# Altium project Deej Board.PrjPcb
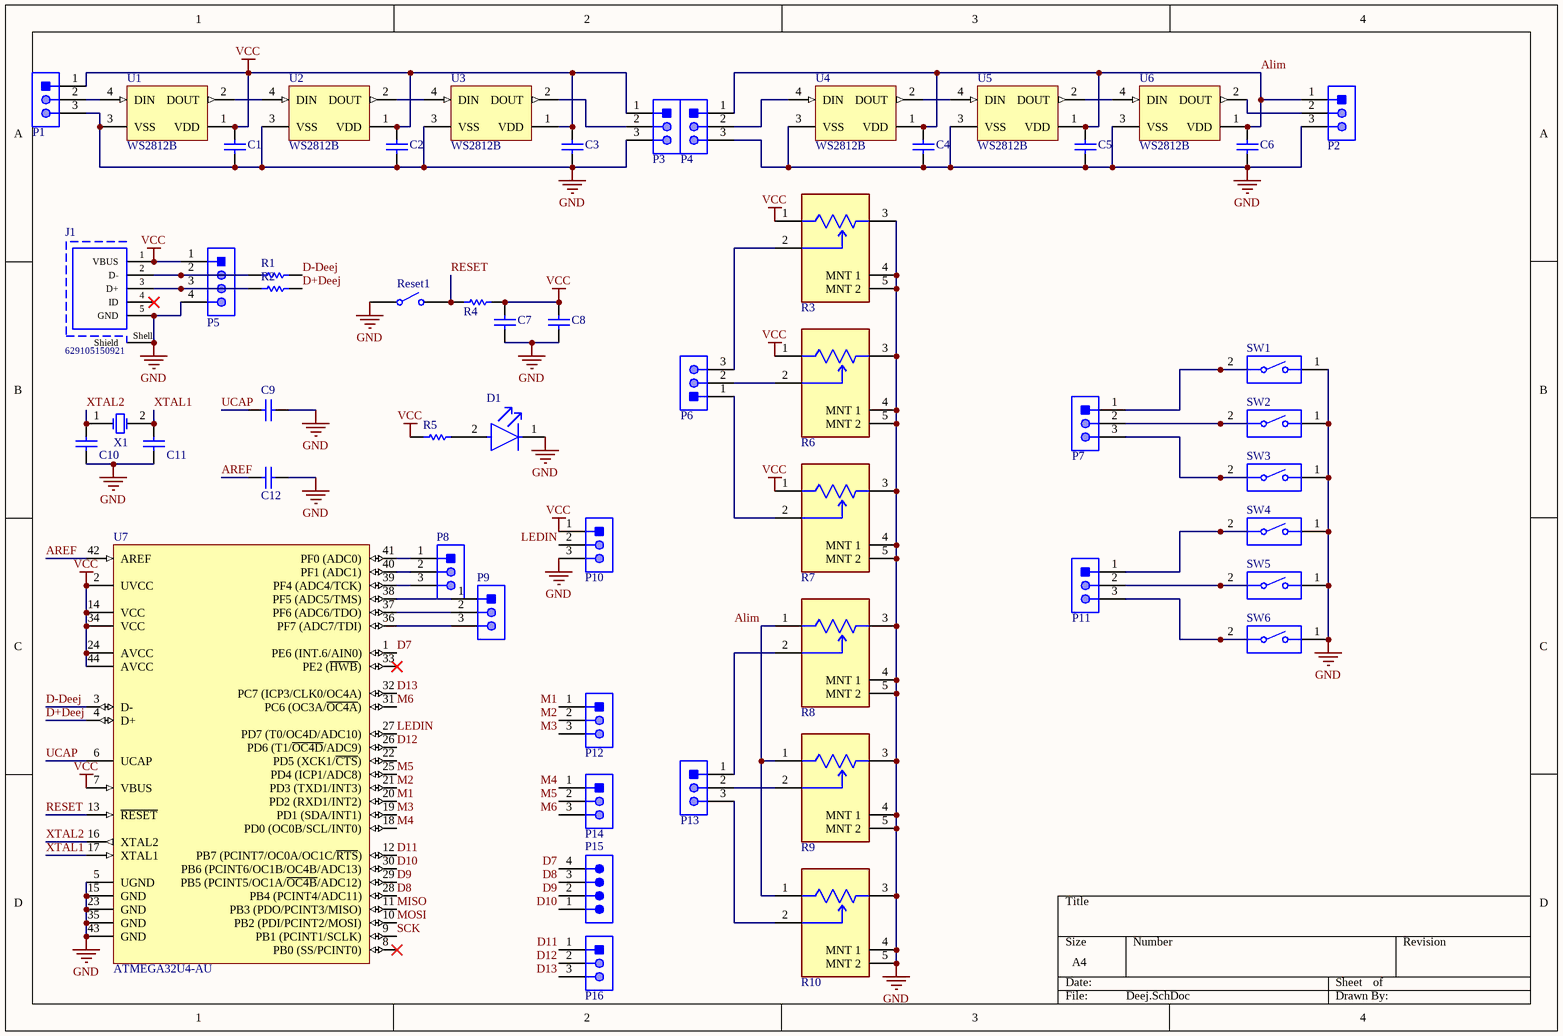
[diagram p0: Deej.SchDoc]
2 sheets, 87 parts. Net scope: global (net labels, ports and power ports of the same name join across sheets).
Board files: V1.PcbDoc, V2.PcbDoc, PCB1.PcbDoc
Sheets:
  Deej.SchDoc
  usb HUB.SchDoc

## Sheet Deej.SchDoc
size A4

### Parts
C1  GRM31C5C1E104JA01L  [CAPC3216X180X55LL20T25]  (value not drawn)
C2  GRM31C5C1E104JA01L  [CAPC3216X180X55LL20T25]  (value not drawn)
C3  GRM31C5C1E104JA01L  [CAPC3216X180X55LL20T25]  (value not drawn)
C4  GRM31C5C1E104JA01L  [CAPC3216X180X55LL20T25]  (value not drawn)
C5  GRM31C5C1E104JA01L  [CAPC3216X180X55LL20T25]  (value not drawn)
C6  GRM31C5C1E104JA01L  [CAPC3216X180X55LL20T25]  (value not drawn)
C7  GRM31C5C1E104JA01L  [CAPC3216X180X55LL20T25]  (value not drawn)
C8  GRM31C5C1E104JA01L  [CAPC3216X180X55LL20T25]  (value not drawn)
C9  C1206C105K3RACTU  [CAPC3216X180X50ML20T25]  (value not drawn)
C10  CAP 22pF 50V 1206(3216)  [CAPC1206(3216)100_N]  (value not drawn)
C11  CAP 22 pF 50V 1206(3216)  [CAPC1206(3216)100_N]  (value not drawn)
C12  GRM31C5C1E104JA01L  [CAPC3216X180X55LL20T25]  (value not drawn)
D1  APTD3216CGCK  [FP-APTD3216CGCK-MFG]  (value not drawn)
J1  629105150921  [629105150921]
P1  22-28-4033  [MOLX-22-28-4033_V]  (value not drawn)
P2  22-28-4033  [MOLX-22-28-4033_V]  (value not drawn)
P3  22-28-4033  [MOLX-22-28-4033_V]  (value not drawn)
P4  22-28-4033  [MOLX-22-28-4033_V]  (value not drawn)
P5  61300411121  [61300411121]  (value not drawn)
P6  22-28-4033  [MOLX-22-28-4033_V]  (value not drawn)
P7  22-28-4033  [MOLX-22-28-4033_V]  (value not drawn)
P8  22-28-4033  [MOLX-22-28-4033_V]  (value not drawn)
P9  22-28-4033  [MOLX-22-28-4033_V]  (value not drawn)
P10  22-28-4033  [MOLX-22-28-4033_V]  (value not drawn)
P11  22-28-4033  [MOLX-22-28-4033_V]  (value not drawn)
P12  22-28-4033  [MOLX-22-28-4033_V]  (value not drawn)
P13  22-28-4033  [MOLX-22-28-4033_V]  (value not drawn)
P14  22-28-4033  [MOLX-22-28-4033_V]  (value not drawn)
P15  TSW-104-08-T-S  [SMTC-TSW-104-08-X-S]  (value not drawn)
P16  22-28-4033  [MOLX-22-28-4033_V]  (value not drawn)
R1  ERJ-8GEYJ220V  [RESC3216X70X50NL05T20]  (value not drawn)
R2  ERJ-8GEYJ220V  [RESC3216X70X50NL05T20]  (value not drawn)
R3  PTV09A-4020U-B103  [FP-PTV09A-4-MFG]  (value not drawn)
R4  ERJ-P08J103V  [RESC3216X70X50LL05T20]  (value not drawn)
R5  ERJ8ENF2203V  [RESC3216X70X50LL05T20]  (value not drawn)
R6  PTV09A-4020U-B103  [FP-PTV09A-4-MFG]  (value not drawn)
R7  PTV09A-4020U-B103  [FP-PTV09A-4-MFG]  (value not drawn)
R8  PTV09A-4020U-B103  [FP-PTV09A-4-MFG]  (value not drawn)
R9  PTV09A-4020U-B103  [FP-PTV09A-4-MFG]  (value not drawn)
R10  PTV09A-4020U-B103  [FP-PTV09A-4-MFG]  (value not drawn)
Reset1  434121025816  [434121025816]  (value not drawn)
SW1  MX1A-11NW  [CHRY-MX1A-11NW_V]  (value not drawn)
SW2  MX1A-11NW  [CHRY-MX1A-11NW_V]  (value not drawn)
SW3  MX1A-11NW  [CHRY-MX1A-11NW_V]  (value not drawn)
SW4  MX1A-11NW  [CHRY-MX1A-11NW_V]  (value not drawn)
SW5  MX1A-11NW  [CHRY-MX1A-11NW_V]  (value not drawn)
SW6  MX1A-11NW  [CHRY-MX1A-11NW_V]  (value not drawn)
U1  WS2812B  [ADAI-WS2812B_V]
U2  WS2812B  [ADAI-WS2812B_V]
U3  WS2812B  [ADAI-WS2812B_V]
U4  WS2812B  [ADAI-WS2812B_V]
U5  WS2812B  [ADAI-WS2812B_V]
U6  WS2812B  [ADAI-WS2812B_V]
U7  ATMEGA32U4-AU  [ATML-44ML_M]
X1  9C-3.6864MBBK-T  [TXC-9C-2_V]  (value not drawn)

### Nets
GND: C1.1 C2.1 C3.1 C4.1 C5.1 C6.1 C7.1 C8.1 C9.2 C10.1 C11.1 C12.1 D1.1(C) J1.5(GND) J1.Shell(Shield) P1.3 P2.3 P3.3 P4.3 P5.4 P10.3 R3.3 R3.4(MNT_1) R3.5(MNT_2) R6.3 R6.4(MNT_1) R6.5(MNT_2) R7.3 R7.4(MNT_1) R7.5(MNT_2) R8.3 R8.4(MNT_1) R8.5(MNT_2) R9.3 R9.4(MNT_1) R9.5(MNT_2) R10.3 R10.4(MNT_1) R10.5(MNT_2) Reset1.1 SW1.1 SW2.1 SW3.1 SW4.1 SW5.1 SW6.1 U1.3(VSS) U2.3(VSS) U3.3(VSS) U4.3(VSS) U5.3(VSS) U6.3(VSS) U7.5(UGND) U7.15(GND) U7.23(GND) U7.35(GND) U7.43(GND)
VCC: C1.2 C2.2 C3.2 C7.2 C8.2 J1.1(VBUS) P1.1 P3.1 P5.1 P10.1 R3.1 R4.1 R5.1 R6.1 R7.1 U1.1(VDD) U2.1(VDD) U3.1(VDD) U7.2(UVCC) U7.7(VBUS) U7.14(VCC) U7.24(AVCC) U7.34(VCC) U7.44(AVCC)
Alim: C4.2 C5.2 C6.2 P2.1 P4.1 R8.1 R9.1 R10.1 U4.1(VDD) U5.1(VDD) U6.1(VDD)
AREF: C12.2 U7.42(AREF)
D7: P15.4 U7.1(PE6_(INT.6/AIN0))
D8: P15.3 U7.28(PB4_(PCINT4/ADC11))
D9: P15.2 U7.29(PB5_(PCINT5/OC1A/~{OC4B}/ADC12))
D10: P15.1 U7.30(PB6_(PCINT6/OC1B/OC4B/ADC13))
D11: P16.1 U7.12(PB7_(PCINT7/OC0A/OC1C/~{RTS}))
D12: P16.2 U7.26(PD6_(T1/~{OC4D}/ADC9))
D13: P16.3 U7.32(PC7_(ICP3/CLK0/OC4A))
D+Deej: R2.2 U7.4(D+)
D-Deej: R1.2 U7.3(D-)
LEDIN: P10.2 U7.27(PD7_(T0/OC4D/ADC10))
M1: P12.1 U7.20(PD2_(RXD1/INT2))
M2: P12.2 U7.21(PD3_(TXD1/INT3))
M3: P12.3 U7.19(PD1_(SDA/INT1))
M4: P14.1 U7.18(PD0_(OC0B/SCL/INT0))
M5: P14.2 U7.25(PD4_(ICP1/ADC8))
M6: P14.3 U7.31(PC6_(OC3A/~{OC4A}))
MISO: U7.11(PB3_(PDO/PCINT3/MISO))
MOSI: U7.10(PB2_(PDI/PCINT2/MOSI))
RESET: R4.2 Reset1.2 U7.13(~{RESET})
SCK: U7.9(PB1_(PCINT1/SCLK))
UCAP: C9.1 U7.6(UCAP)
XTAL1: C11.2 U7.17(XTAL1) X1.2(X2)
XTAL2: C10.2 U7.16(XTAL2) X1.1(X1)
NetD1_2: D1.2(A) R5.2
NetJ1_2: J1.2(D-) P5.2 R1.1
NetJ1_3: J1.3(D+) P5.3 R2.1
NetP1_2: P1.2 U1.4(DIN)
NetP2_2: P2.2 U6.2(DOUT)
NetP3_2: P3.2 U3.2(DOUT)
NetP4_2: P4.2 U4.4(DIN)
NetP6_1: P6.1 R7.2
NetP6_2: P6.2 R6.2
NetP6_3: P6.3 R3.2
NetP7_1: P7.1 SW1.2
NetP7_2: P7.2 SW2.2
NetP7_3: P7.3 SW3.2
NetP8_1: P8.1 U7.41(PF0_(ADC0))
NetP8_2: P8.2 U7.40(PF1_(ADC1))
NetP8_3: P8.3 U7.39(PF4_(ADC4/TCK))
NetP9_1: P9.1 U7.38(PF5_(ADC5/TMS))
NetP9_2: P9.2 U7.37(PF6_(ADC6/TDO))
NetP9_3: P9.3 U7.36(PF7_(ADC7/TDI))
NetP11_1: P11.1 SW4.2
NetP11_2: P11.2 SW5.2
NetP11_3: P11.3 SW6.2
NetP13_1: P13.1 R8.2
NetP13_2: P13.2 R9.2
NetP13_3: P13.3 R10.2
NetU1_2: U1.2(DOUT) U2.4(DIN)
NetU2_2: U2.2(DOUT) U3.4(DIN)
NetU4_2: U4.2(DOUT) U5.4(DIN)
NetU5_2: U5.2(DOUT) U6.4(DIN)

Not connected (* = marked no-connect by the designer): J1 4(ID)*; U7 8(PB0_(SS/PCINT0))* 22(PD5_(XCK1/~{CTS})) 33(PE2_(~{HWB}))*

### Library data of the parts
C1-C8 C12 = CMP-2000-06343-1: Chip Capacitor, 100 nF, +/- 5%, 25 V, -55 to 125 degC, 1206 (3216 Metric), RoHS, Tape and Reel; Manufacturer: Murata; External Width: 0.5mm; Voltage Rating V DC: 25V; Capacitor Case Style: 1206[3216Metric]; Insulation Resistance: 10000Mohm; Capacitor Terminals: SMD; Capacitance: 0.1µF; Temperature Coefficient: 0ppm/°C±30ppm/°C; External Length / Height: 1mm; Reel Quantity: 2000; Dielectric Characteristic: C0G/NP0; SVHC: NoSVHC(19-Dec-2012); No. of Pins: 2; Manufacturer URL: http://www.murata.com/; Mounting Technology: SurfaceMount; Operating Temperature Range: -55°Cto+125°C; Operating Temperature Max: 125°C; Package Description: 2-Pin Surface Mount Device, Body 3.2 x 1.6 mm; Operating Temperature Min: -55°C; Terminal Type: SurfaceMount(SMD,SMT); MSL: –; Tolerance +: 5%; Voltage Rating: 25V; Datasheet URL: https://datasheet.ciiva.com/3777/11308grm31c5c1e104ja0123-3777177.pdf; Datasheet Version: 09/2014; Package / Case: 1206; Capacitance Tolerance: ±5%; Package Reference: 1206; Lead Spacing: –; Tolerance -: 5%
C9 = CMP-2000-04991-1: Chip Capacitor, 1 uF, +/- 10%, 25 V, -55 to 125 degC, 1206 (3216 Metric), RoHS, Tape and Reel; Manufacturer: Kemet; Temperature Coefficient / Code: +/-15%; Capacitance: 1uF; Dielectric: X7R; Voltage Rating DC: 25V; Capacitance - nF: 1000nF; Class: Class1; Case Length: 3.2mm; Type: SMDMLCCX7R6.3-250VDCCommericalGrade; Case Width: 1.6mm; Product: GeneralTypeMLCCs; Datasheet URL: https://ciiva.com/datasheet-click-18194173?src=ciiva&sig=6daff8c4; Operating Temperature Range: -55Cto+125C; Series: C1206C; RoHS: Details; Product Category: MultilayerCeramicCapacitorsMLCC-SMD/SMT; Manufacturer URL: http://www.kemet.com/; Minimum Operating Temperature: -55C; Dimensions: 1.6mmWx3.2mmLx1.6mmH; Termination Style: SMD/SMT; Brand: Kemet; Packaging: Reel; Package / Case: 1206(3216metric); Case Code - mm: 3216; Datasheet Version: Jul-14; Factory Pack Quantity: 2000; Package Description: 2-Pin Surface Mount Device, Body 3.2 x 1.6 mm; Tolerance: 10%; Package Reference: 1206; Case Height: 1.6mm; Case Code - in: 1206; Maximum Operating Temperature: +125C; Voltage Rating: 25V
C10 C11 = CMP-1037-03764-1: CAP 22nF 50V ±5% 1206 (3216 Metric) Thickness 1mm SMD; Tolerance: Â±5%; Case-Metric: 3216; Case-EIA: 1206; Technology: SMT; Rated Voltage: 50 V; Max Thickness: 1 mm; Value: 22nF
D1 = CMP-2000-05792-2: LED GREEN CLEAR 2SMD; Forward Voltage: 2.1V; Forward Current: 20mA; Luminous Intensity: 300mcd; Number of LEDs: 1; Dominant Wavelength: 570nm; Viewing Angle: 50°; Lead Free: Lead Free; Lens Color: Clear; Mount: Surface Mount; Package Quantity: 2000; Height: 1.8mm; Number of Pins: 2; Test Current: 20mA; Case Code (Metric): 3216; Case/Package: 1206; Case Code (Imperial): 1206; Illumination Color: Green; Color: Green; Width: 1.6mm; Packaging: Tape and Reel; Min Operating Temperature: -40°C; Lens Style: Clear; Max Operating Temperature: 85°C; Length: 3.2mm
J1 = CMP-1502-03249-1: Micro USB 2.0 Type AB Receptacle WR-COM, Horizontal, SMT; Manufacturer: Wurth Elektronik; Rated Current: 1.8A; Contact Resistance: 30mOhm; Working Voltage: 30VAC; Publisher: WurthElektronik; Part Number: 629105150921; Operating Temperature: -40to85degC; Gender: Receptacle; Packaging: TapeandReel; Connector Type: MicroUSB2.0TypeAB; Datasheet URL: https://katalog.we-online.de/em/datasheet/629105150921.pdf; Mounting Technology: SMT; Orientation: Horizontal; Package Reference: 629105150921; Manufacturer URL: http://www.we-online.de
P1-P4 P6-P14 P16 = CMP-1676-00001-5: Male Header, Pitch 2.54 mm, 1 x 3 Position, Height 8.38 mm, Tail Length 3.18 mm, RoHS, Bulk; Manufacturer: Molex; Rows: 1; Voltage Rating: 250 V; Current Rating: 4 A; Min Operating Temperature: 0 degC; Lead Pitch: 0.1 inch; Packaging: Bulk; Contact Finish: Gold; RoHSCompliant: true; Contact Material: Brass; PackageReference: 22-28-4033; REACH SVHC: Unknown; PackageDescription: Male Header, Pitch 2.54 mm, 1 x 3 Position, Height 8.38 mm, Tail Length 3.18 mm; ComponentLink2URL: http://www.molex.com/pdm_docs/sd/022284033_sd.pdf; Height: 8.38 mm; Mounting Technology: Through Hole; ComponentLink1Description: Manufacturer URL; Length: 7.62 mm; Mount: Through Hole; DatasheetVersion: Rev. G, 01/2012; Max Operating Temperature: 75 degC; ComponentLink2Description: Datasheet; Colour: Black; Pins: 3; Contact Plating: Gold; Package Quantity: 1; ComponentLink1URL: http://www.molex.com/
P5 = CMP-1502-01064-1: THT Vertical Pin Header WR-PHD, Pitch 2.54 mm, Single Row, 4 pins; Manufacturer: Wurth Elektronik; Withstanding Voltage: 500VAC; Rated Current: 3A; Working Voltage: 250VAC; Pin Number: 4; Gender: Male; Contact Resistance: 20mOhm; Pitch: 2.54mm; Manufacturer URL: http://www.we-online.de; Operating Temperature: -40to105degC; Packaging: Bag; Mounting Technology: THT; Package Reference: 61300411121; Datasheet URL: https://katalog.we-online.de/em/datasheet/6130xx11121.pdf; Publisher: WurthElektronik; Part Number: 61300411121; Row Number: Single; Orientation: Vertical
P15 = CMP-1024-00356-1: 0.025" SQ Post Header, Through-hole, Vertical, -55 to 105 degC, 2.54 mm Pitch, 4-Pin, Male, RoHS; Manufacturer: Samtec; Pitch: 2.54 mm; PackageDescription: .025[0.64] SQ. Post Terminal Strip Assembly; ComponentLink2URL: http://www.samtec.com/documents/webfiles/pdf/TSW_TH.PDF; ComponentLink3URL: http://www.samtec.com/documents/webfiles/cpdf/TSW-XXX-XX-XXX-X-XX-XXX-MKT.pdf; PackageVersion: DM, 8/1988; ComponentLink3Description: Package Specification; DatasheetVersion: F-214; Orientation: Vertical; RoHS: True; Mounting Technology: Through-hole; ComponentLink1URL: http://www.samtec.com; PartNumber: TSW-104-08-T-S; ComponentLink1Description: Manufacturer URL; Temperature Range: -55 to 105 degC; ComponentLink2Description: Datasheet; PackageReference: TSW-104-08-X-S
R1 R2 = CMP-2003-00585-1: Manufacturer: Panasonic; Part Number: ERJ-8GEYJ220V
R3 R6-R10 = CMP-07234-000013-1: POT 10K OHM 1/20W CARBON LINEAR; Manufacturer: Bourns Inc.; Voltage Rating: 50V; Resistance: 10kΩ; Tolerance: 20%; Value: 10kΩ; Power Rating: 0.05W; Composition: Carbon; Lead Free: Yes; Device Class L1: Passive Components; Device Class L3: Variable Resistors and Potentiometers; Temperature: -10°C to +50°C; Series: PTV09; Manufacturer Part Number: PTV09A-4020U-B103; Device Class L2: Resistors; Temperature Range Low: -10°C; Height: 20.5mm; Temperature Range High: +50°C; Octopart: https://octopart.com/ptv09a-4020u-b103-bourns-1878033; Digikey Description: POT 10K OHM 1/20W CARBON LINEAR; RoHS: TRUE; ComponentLink2URL: https://www.bourns.com/docs/product-datasheets/ptv09.pdf?sfvrsn=5e1089f1_12; Package: PTV09A-4; Mouser Description: Potentiometers 10K LINEAR 20%; Category: Res; ComponentLink2Description: Datasheet; Automotive: No
R4 = CMP-2003-00715-1: Manufacturer: Panasonic; Part Number: ERJ-P08J103V
R5 = CMP-2003-00820-1: Manufacturer: Panasonic; Part Number: ERJ8ENF2203V
Reset1 = CMP-1459-00004-1: WS-TASV SMD Tact Switch 6.0X3.8 mm; Manufacturer: Wuerth Elektronik; NoPins: 02; PackageReference: 434121025816; ComponentLink2URL: http://katalog.we-online.de/em/datasheet/434121025816.pdf; PartNumber: 434121025816; ComponentLink2Description: Datasheet; ComponentLink1URL: http://www.we-online.com; ComponentLink1Description: Manufacturer URL
SW1-SW6 = CMP-2000-06786-1: Keylock Switch, 12 V, -10 to 70 degC, 2-Pin THD, RoHS, Bulk; Manufacturer: Cherry; Part No: MX1A11NW; Maximum DC Voltage Rating: 12V; COO: UK; Row Spacing: 6.35mm; Pole Throw Configuration: SPST; Total Travel: 4.06mm; Illumination Type: N/R; Actuator Style: Button; Operating Force: 0.58N; Electrical Life: 50000000Cycle; Minimum Insulation Resistance: 100MOhm; Body Orientation: Straight; Actuator Length: 3.6mm; Switch Configuration: N.O.; Maximum Current Rating: 0.01A; Maximum Contact Resistance: 200mOhm; Actuator Color: N/A; Terminal Type: PCPins; Operating Temperature: -10to70C; Number of Terminals: 2; Operating Speed: N/A; Maximum AC Voltage Rating: 12V; Housing Material: N/A; Datasheet URL: https://cdn.sparkfun.com/datasheets/Components/Switches/MX%20Series.pdf; Type: DesktopProfile; Terminal Pitch: 2.54mm; Package Reference: MX1A-11NW; ECCN: EAR99; Family: MX; Packaging: N/A; HTS: 8536509065; Actuator Material: N/A; Package Description: 2-Pin Through Hole Device, Body 15.6 x 15.6 mm; Dielectric Strength: N/A; Illumination Color: N/R; Manufacturer URL: http://cherryswitches.com/cn/; Dimension: 15.6x15.6x15.2mm; Mechanical Life: N/A; RoHS: Unknown; Contact Plating: N/A; Supplier: CherryElectrical; Contact Material: Silver/Gold; IP Rating: N/A; Mounting: ThroughHole; Datasheet Version: 09/2000; Maximum Power Rating: N/A; Mounting Technology: ThroughHole
U1-U6 = CMP-007-00035-1: Intelligent Control LED Integrated Light Source, 3.5 to 5.3 V, -25 to 80 degC, 4-Pin SMD, RoHS, Bulk; Manufacturer: Adafruit Industries; Mounting Technology: SM; Case/Package: WS2812B; Datasheet URL: https://cdn-shop.adafruit.com/datasheets/WS2812B.pdf; Manufacturer URL: https://www.adafruit.com/; Package Reference: WS2812B; Package Description: 4-Pin Surface Mount Device, Body 5 x 5 mm, Pitch 3.3 mm; RoHS Compliant: False; Datasheet Version: May-13
U7 = CMP-020-00016-2: 8-bit Microcontroller with 32 Kbytes of ISP Flash and USB Controller, 2.7 to 5.5 V, -40 to 85 degC, 44-Pin QFP, Tray; Manufacturer: Atmel; Package Version: Rev. J, 02/2014; Min Supply Voltage: 2.7V; PWM Channels: 8; Ethernet Channels: 0; I/Os: 26; Max Clock Frequency: 16MHz; Density: 32KB; ADC Channels: 12; Max Supply Voltage: 5.5V; Interface: USART; RAM Size: 2.5KB; Pins: 44; Package Description: 44-Pin Thin Profile Plastic Quad Flat Papckage, Body 10 x 10 mm, Pitch 0.8 mm; Case/Package: TQFP; Packaging: Tray; Package URL: http://www.atmel.com/images/atmel-7766-8-bit-avr-atmega16u4-32u4_summary.pdf; Package Reference: 44ML; Mounting Technology: SM; Datasheet Version: Rev. 7766IS, 07/2015; RoHS Compliant: True; Frequency: 16MHz; Max Operating Temperature: 85°C; Package Quantity: 800; Min Operating Temperature: -40°C; Manufacturer URL: http://www.atmel.com/; Datasheet URL: http://www.atmel.com/images/atmel-7766-8-bit-avr-atmega16u4-32u4_summary.pdf
X1 = CMP-0724-00001-1: 9C Series Quartz Crystal, 3.6864 MHz, +/-50 ppm, 20 pF, -40 to 85 degC, 2-Pin 11.4 x 4.8 x 4.1 mm SMD, RoHS, Tape and Reel; Manufacturer: TXC; Load Capacitance: 20 pF; Frequency Stability (over Temp.): +/-50 ppm (-20 to 70 degC); PackageVersion: Jun-10; PackageDescription: 2-Pin SMD, Body 11.4 x 4.8 mm, Height 4.1 mm; Packing: Tape and Reel; PackageReference: 9C-2; ComponentLink2URL: http://www.txccrystal.com/images/pdf/9c.pdf; ComponentLink3URL: http://www.txccrystal.com/images/pdf/9c.pdf; PartNumber: 9C-3.6864MBBK-T; Mounting Technology: Surface Mount; ComponentLink3Description: Package Specification; ComponentLink2Description: Datasheet; Frequency Tolerance (at 25 degC): +/-50 ppm; ComponentLink1URL: http://www.txccrystal.com/; RoHS: TRUE; Frequency: 3.6864 MHz; DatasheetVersion: Jun-10; ComponentLink1Description: Manufacturer URL; Operating Temperature Range: -40 to 85 degC

## Sheet usb HUB.SchDoc
size A4
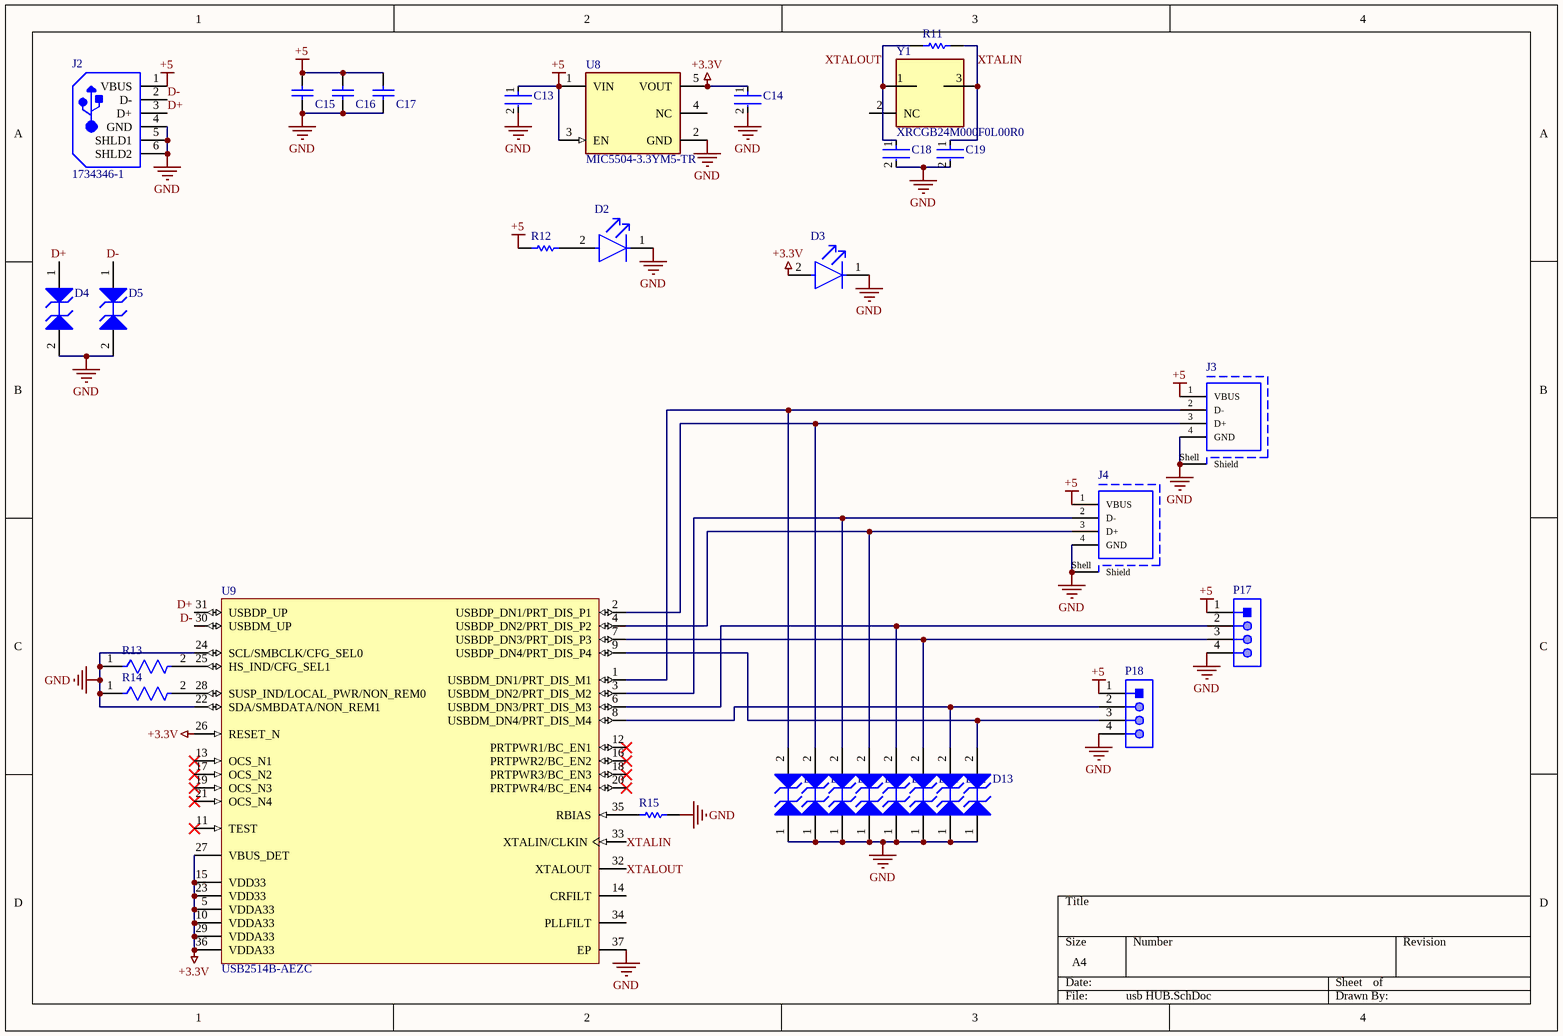
[diagram p1: usb HUB.SchDoc]

### Parts
C13  CL31B105MAHNNNE  [FP-CL31-IPC_B]  (value not drawn)
C14  CL31B105MAHNNNE  [FP-CL31-IPC_B]  (value not drawn)
C15  12061Z475KAT2A  [CAPC3216X190X50ML20T25]  (value not drawn)
C16  12061Z475KAT2A  [CAPC3216X190X50ML20T25]  (value not drawn)
C17  12061Z475KAT2A  [CAPC3216X190X50ML20T25]  (value not drawn)
C18  GRM31A7U2J180JW31D  [FP-GRM31A-0_2-e0_3_0_95-IPC_B]  (value not drawn)
C19  GRM31A7U2J180JW31D  [FP-GRM31A-0_2-e0_3_0_95-IPC_B]  (value not drawn)
D2  APTD3216CGCK  [FP-APTD3216CGCK-MFG]  (value not drawn)
D3  APTD3216CGCK  [FP-APTD3216CGCK-MFG]  (value not drawn)
D4  ESD9B3.3ST5G  [ONSC-SOD-923-2-514AB-01_V]  (value not drawn)
D5  ESD9B3.3ST5G  [ONSC-SOD-923-2-514AB-01_V]  (value not drawn)
D6  ESD9B3.3ST5G  [ONSC-SOD-923-2-514AB-01_V]  (value not drawn)
D7  ESD9B3.3ST5G  [ONSC-SOD-923-2-514AB-01_V]  (value not drawn)
D8  ESD9B3.3ST5G  [ONSC-SOD-923-2-514AB-01_V]  (value not drawn)
D9  ESD9B3.3ST5G  [ONSC-SOD-923-2-514AB-01_V]  (value not drawn)
D10  ESD9B3.3ST5G  [ONSC-SOD-923-2-514AB-01_V]  (value not drawn)
D11  ESD9B3.3ST5G  [ONSC-SOD-923-2-514AB-01_V]  (value not drawn)
D12  ESD9B3.3ST5G  [ONSC-SOD-923-2-514AB-01_V]  (value not drawn)
D13  ESD9B3.3ST5G  [ONSC-SOD-923-2-514AB-01_V]  (value not drawn)
J2  1734346-1  [TECO-1734346-1_V]
J3  629104190121  [629104190121]  (value not drawn)
J4  629104190121  [629104190121]  (value not drawn)
P17  61300411121  [61300411121]  (value not drawn)
P18  61300411121  [61300411121]  (value not drawn)
R11  ERJ-8ENF1004V  [RESC3216X70X50NL05T20]  (value not drawn)
R12  ERJ8ENF2203V  [RESC3216X70X50LL05T20]  (value not drawn)
R13  CRCW120656K0FKEA  [FP-CRCW1206-e3-IPC_C]  (value not drawn)
R14  CRCW120656K0FKEA  [FP-CRCW1206-e3-IPC_C]  (value not drawn)
R15  ERJ-8GEYJ123V  [RESC3216X70X50NL05T20]  (value not drawn)
U8  MIC5504-3.3YM5-TR  [FP-SOT23-5LD-PL-1-MFG]
U9  USB2514B-AEZC  [MCHP-QFN-36_V]
Y1  Part Number: XRCGB24M000F0L00R0  [Murata_XRCGB24M000F0L00R0_0]  (hidden comment: Crys_Murata_XRCGB24M000F0L00R0_eec)

### Nets
+3.3V: C14.1 D3.2(A) U8.5(VOUT) U9.5(VDDA33) U9.10(VDDA33) U9.15(VDD33) U9.23(VDD33) U9.26(RESET_N) U9.27(VBUS_DET) U9.29(VDDA33) U9.36(VDDA33)
+5: C13.1 C15.1 C16.1 C17.1 J2.1(VBUS) J3.1(VBUS) J4.1(VBUS) P17.1 P18.1 R12.1 U8.1(VIN) U8.3(EN)
GND: C13.2 C14.2 C15.2 C16.2 C17.2 C18.2 C19.2 D2.1(C) D3.1(C) D4.2(A2) D5.2(A2) D6.1(A1) D7.1(A1) D8.1(A1) D9.1(A1) D10.1(A1) D11.1(A1) D12.1(A1) D13.1(A1) J2.4(GND) J2.5(SHLD1) J2.6(SHLD2) J3.4(GND) J3.Shell(Shield) J4.4(GND) J4.Shell(Shield) P17.4 P18.4 R13.1 R14.1 R15.2 U8.2(GND) U9.22(SDA/SMBDATA/NON_REM1) U9.24(SCL/SMBCLK/CFG_SEL0) U9.37(EP)
D+: D4.1(A1) J2.3(D+) U9.31(USBDP_UP)
D-: D5.1(A1) J2.2(D-) U9.30(USBDM_UP)
XTALIN: C19.1 R11.2 U9.33(XTALIN/CLKIN) Y1.3(2_Crystal_Terminal)
XTALOUT: C18.1 R11.1 U9.32(XTALOUT) Y1.1(1_Crystal_Terminal)
NetD2_2: D2.2(A) R12.2
NetD6_2: D6.2(A2) J3.2(D-) U9.1(USBDM_DN1/PRT_DIS_M1)
NetD7_2: D7.2(A2) J3.3(D+) U9.2(USBDP_DN1/PRT_DIS_P1)
NetD8_2: D8.2(A2) J4.2(D-) U9.3(USBDM_DN2/PRT_DIS_M2)
NetD9_2: D9.2(A2) J4.3(D+) U9.4(USBDP_DN2/PRT_DIS_P2)
NetD10_2: D10.2(A2) P17.2 U9.6(USBDM_DN3/PRT_DIS_M3)
NetD11_2: D11.2(A2) P17.3 U9.7(USBDP_DN3/PRT_DIS_P3)
NetD12_2: D12.2(A2) P18.2 U9.8(USBDM_DN4/PRT_DIS_M4)
NetD13_2: D13.2(A2) P18.3 U9.9(USBDP_DN4/PRT_DIS_P4)
NetR13_2: R13.2 U9.25(HS_IND/CFG_SEL1)
NetR14_2: R14.2 U9.28(SUSP_IND/LOCAL_PWR/NON_REM0)
NetR15_1: R15.1 U9.35(RBIAS)

Not connected (* = marked no-connect by the designer): U8 4(NC); U9 11(TEST)* 12(PRTPWR1/BC_EN1)* 13(OCS_N1)* 14(CRFILT) 16(PRTPWR2/BC_EN2)* 17(OCS_N2)* 18(PRTPWR3/BC_EN3)* 19(OCS_N3)* 20(PRTPWR4/BC_EN4)* 21(OCS_N4)* 34(PLLFILT); Y1 2(NC)

### Library data of the parts
C13 C14 = CMP-13271-000122-1: Cap Ceramic 1uF 25V X7R ±20% SMD 1206 +125°C Embossed T/R; Radiation Hardening: No; Height: 1.6mm; Mount: Surface Mount; Packaging: Tape and Reel; Width: 0.063inch; Contact Plating: Tin; Package Quantity: 1; Thickness: 0.071inch; Tolerance: 20%; Case/Package: 1206; Length: 3.2mm; Case Code (Imperial): 1206; Dielectric: X7R; Voltage Rating: 25V; Depth: 1.6mm; Voltage Rating (DC): 25V; Max Operating Temperature: 125°C; Case Code (Metric): 3216; Min Operating Temperature: -55°C; Lead Free: Lead Free; Capacitance: 1uF
C15-C17 = CMP-2000-05019-1: Chip Capacitor, 4.7 uF, +/- 10%, 100 V, -55 to 125 degC, 1206 (3216 Metric), RoHS, Tape and Reel; Manufacturer: AVX; Dielectric Characteristic: X7S; Voltage Rating: 100V; SVHC: NoSVHC(17-Dec-2015); Ceramic Capacitor Case: 1206[3216Metric]; Capacitance: 4.7µF; Packaging: CutTape; Datasheet Version: Oct-13; Operating Temperature Max: 125degC; Manufacturer URL: http://www.avx.com/; MSL: MSL1-Unlimited; Datasheet URL: https://datasheet.ciiva.com/22677/1789384-22677168.pdf; Capacitance Tolerance: ±10%; Operating Temperature Min: -55degC
C18 C19 = CMP-06035-014678-1: Chip Multilayer Ceramic Capacitors for General Purpose, 1206, 18pF, U2J, -750ppm/°C, 5%, 630V; Case Code (Metric): 3216; Termination: SMD/SMT; Case Code (Imperial): 1206; Lead Free: Lead Free; Package Quantity: 4000; Voltage Rating: 630V; Case/Package: 1206; Radiation Hardening: No; Capacitance: 18pF; REACH SVHC: No SVHC; Thickness: 0.039inch; Min Operating Temperature: -55°C; Mount: Surface Mount; Depth: 1.6mm; Dielectric: U2J; Packaging: Tape and Reel; Max Operating Temperature: 125°C; Length: 3.2mm; Width: 0.063inch; Tolerance: 5%; Voltage Rating (DC): 630V; Height: 1mm
D2 D3 = CMP-2000-05792-2: as D1 on sheet Deej; Lead Free: Lead Free; Lens Color: Clear; Mount: Surface Mount; Package Quantity: 2000; Height: 1.8mm; Number of Pins: 2; Test Current: 20mA; Case Code (Metric): 3216; Case/Package: 1206; Case Code (Imperial): 1206; Illumination Color: Green; Color: Green; Width: 1.6mm; Packaging: Tape and Reel; Min Operating Temperature: -40°C; Lens Style: Clear; Max Operating Temperature: 85°C; Length: 3.2mm
D4-D13 = CMP-1063-00120-1: Transient Voltage Suppressor, Micro-Packaged Diode for ESD Protection, 2-Pin SOD-923, Pb-Free, Tape and Reel; Manufacturer: On Semiconductor; Number of Lines: 1; V(BR) Min (V): 5; VRWM Max (V): 3.3; Direction: Bidirectional; ComponentLink3URL: http://www.onsemi.com/pub_link/Collateral/514AB.PDF; PartNumber: ESD9B3.3ST5G; PackageVersion: Rev. C, 03/2011; Mounting Technology: Surface Mount; PackageReference: SOD-923-2-514AB-01; RoHS: Pb-Free; DatasheetVersion: Rev. 2; ComponentLink1URL: http://www.onsemi.com/; PackageDescription: 2-Pin SOD, Body 0.8 x 0.6 mm; ComponentLink3Description: Package Specification; ComponentLink2URL: http://www.onsemi.cn/pub_link/Collateral/ESD9B-D.PDF; IR Max (uA): 1; Packing: Tape and Reel; ComponentLink2Description: Datasheet; ComponentLink1Description: Manufacturer URL
J2 = CMP-2000-07498-1: USB-B Receptacle Connector, Height 10.87 mm, 0 to 50 degC, RoHS, Tray; Manufacturer: TE Connectivity; Insulation Resistance: 1GR; Number of Contacts: 4; Number of Ports: 1; Plating: Nickel; Case\/Package: SMD/SMT; Insulation Material: Thermoplastic; Gender: Receptacle; Depth: 16mm; Contact Material: Bronze; Length: 16.5mm; ELV: Compliant; Packaging: Tray; RoHSCompliant: true; Number of Terminals: 4; Manufacturer URL: http://www.te.com/; Datasheet Version: Rev. C, 06/2011; Package Reference: 1734346-1; Flammability Rating: UL94V-0; Package Description: 4-Pin Pin Surface Mount Device, Body 12.04 x 16 mm, Height 10.87 mm; Mount: Horizontal; Mounting Technology: SurfaceMount; REACH SVHC: Unknown; Material: Bronze; Housing Colour: Black; Contact Plating: Gold; Package Quantity: 100; Orientation: RightAngle; Termination: SMD/SMT; Housing Material: Nylon; Number of Positions: 4; Datasheet URL: http://www.te.com/commerce/DocumentDelivery/DDEController?Action=srchrtrv&DocNm=1734346&DocType=Customer+Drawing&DocLang=English; Connector Type: Receptacle
J3 J4 = CMP-1502-03232-1: USB 2.0 Type A Receptacle WR-COM, Horizontal, SMT, Short Type with Pads and Pegs; Manufacturer: Wurth Elektronik; Contact Resistance: 30mOhm; Rated Current: 1.5A; Working Voltage: 30VAC; Orientation: Horizontal; Package Reference: 629104190121; Connector Type: USB2.0TypeA; Operating Temperature: -40to85degC; Publisher: WurthElektronik; Manufacturer URL: http://www.we-online.de; Mounting Technology: SMT; Packaging: TapeandReel; Datasheet URL: https://katalog.we-online.de/em/datasheet/629104190121.pdf; Part Number: 629104190121; Gender: Receptacle
P17 P18 = CMP-1502-01064-1: as P5 on sheet Deej; Manufacturer URL: http://www.we-online.de; Operating Temperature: -40to105degC; Packaging: Bag; Mounting Technology: THT; Package Reference: 61300411121; Datasheet URL: https://katalog.we-online.de/em/datasheet/6130xx11121.pdf; Publisher: WurthElektronik; Part Number: 61300411121; Row Number: Single; Orientation: Vertical
R11 = CMP-2003-00020-1: Manufacturer: Panasonic; Part Number: ERJ-8ENF1004V
R12 = CMP-2003-00820-1: Manufacturer: Panasonic; Part Number: ERJ8ENF2203V
R13 R14 = CMP-2003-02282-2: RES Thick Film, 56kΩ, 1%, 0.25W, 100ppm/°C, 1206; Voltage Rating (DC): 200V; Resistance: 56kR; Power Rating: 250mW; Packaging: Tape and Reel; Case/Package: 1206; Lead Free: Lead Free; Height: 0.55mm; Max Operating Temperature: 155°C; Case Code (Metric): 3216; Tolerance: 1%; Contact Plating: Tin; Min Operating Temperature: -55°C; Termination: SMD/SMT; Voltage Rating: 200V; Number of Pins: 2; Radiation Hardening: No; Military Standard: Not; Depth: 1.6mm; Composition: Thick Film; Number of Terminations: 2; Package Quantity: 10; Temperature Coefficient: 100ppm/°C; Width: 0.063inch; Case Code (Imperial): 1206; Weight: 0.000353oz; Length: 3.2mm; Max Power Dissipation: 250mW; Features: Automotive AEC-Q200
R15 = CMP-2003-00554-1: Manufacturer: Panasonic; Part Number: ERJ-8GEYJ123V
U8 = CMP-2000-07604-2: IC REG LINEAR 3.3V 300MA SOT23-5; Quiescent Current: 38uA; Operating Supply Current: 42uA; Max Input Voltage: 5.5V; Min Input Voltage: 2.5V; Output Type: Fixed; Power Supply Rejection Ratio (PSRR): 60dB; Dropout Voltage: 380mV; Accuracy: 3%; Number of Outputs: 1; Nominal Output Voltage: 3.3V; Max Output Current: 300mA; Length: 2.9mm; Mount: Surface Mount; Width: 1.6mm; Packaging: Tape and Reel; Output Current: 300mA; Min Operating Temperature: -40°C; Max Operating Temperature: 125°C; Height: 1.1mm; Case/Package: SOT-23-5; REACH SVHC: No SVHC; Number of Pins: 5; Output Voltage: 3.3V
U9 = CMP-2000-05217-1: USB 2.0 High-Speed Hub Controller, 4 Ports, 3 to 3.6 V, 0 to 85 degC, 36-Pin QFN, RoHS, Tray; Manufacturer: Microchip; Interface: I²CEEPROM,SMBus(2-Wire,I²C); Other Names: 638-1122; Voltage - Supply: 3V~3.6V; Current - Supply: 70mA; Manufacturer URL: http://www.microchip.com/; Packaging: Tray; Function: -; Standards: -; Category: IntegratedCircuits(ICs); Package / Case: 36-VFQFNExposedPad; Supplier Device Package: 36-QFN(6x6); Family: Interface-Controllers; Datasheet Version: DS00001692C, 10/2015; Standard Package: 490; Series: -; Protocol: -; Datasheet URL: http://ww1.microchip.com/downloads/en/DeviceDoc/00001692C.pdf; Operating Temperature: -; Manufacturer Part Number: USB2514B-AEZC
Y1 = Crys_Murata_XRCGB24M000F0L00R0_eec: CRYS 24MHz ±100ppm Crystal 6pF 150 Ohm -30°C ~ 85°C Surface Mount 4-SMD, No Lead; Manufacturer: Murata; Frequency Tolerance: ±100ppm max. (25±3℃); Frequency Shift by Temperature: ±50ppm max.; Drive Level(max.): 300μW; Equivalent Series Resistance(max.): 150Ω; Frequency: 24.0000MHz; helpURL: https://upverter.com/upn/revision/aff6462790ac0861/; ComponentLink2Description: Datasheet; Temperature: -30°C to +85°C; Package: SMT_2MM0_1MM6; Supplier 2: Mouser; Price: 0.196763354289; Supplier 1: Digi-Key; ComponentLink1URL: https://upverter.com/upn/revision/aff6462790ac0861/; Supplier Part Number 2: 81-XRCGB24M000F0L0R0; Supplier Part Number 1: 490-5575-1-ND; ComponentLink1Description: Upverter; ComponentLink2URL: http://www.murata.com/~/media/webrenewal/support/library/catalog/products/timingdevice/crystalu/p79e.ashx; RoHS: TRUE; Mouser Part Number: 81-XRCGB24M000F0L0R0; Temperature Range High: +85°C; Digikey Description: CRYS 24MHz ±100ppm Crystal 6pF 150 Ohm -30°C ~ 85°C Surface Mount 4-SMD, No Lead; Digikey Part Number: 490-5575-1-ND; Lead Free: yes; Frequency Aging: ±50ppm max.; Temperature Range Low: -30°C; Load Capacitance: 6pF

## Nets that join several sheets
GND: Deej (57 pins), usb HUB (35 pins)